# Altium schematic sheet ConnectTech.SchDoc: Sample Sheet Title
size B; Date: MM/DD/YYYY; Author: Sample Author; Organization: ORGANIZATION; Address1: ADDRESS 1; Address2: ADDRESS 2; Address3: ADDRESS 3; Address4: ADDRESS 4; Revision: -; SheetNumber: 1; SheetTotal: 1; ENG_APP_DATE: --/--/--; DSN_APP_DATE: --/--/--; CHK_APP_DATE: --/--/--
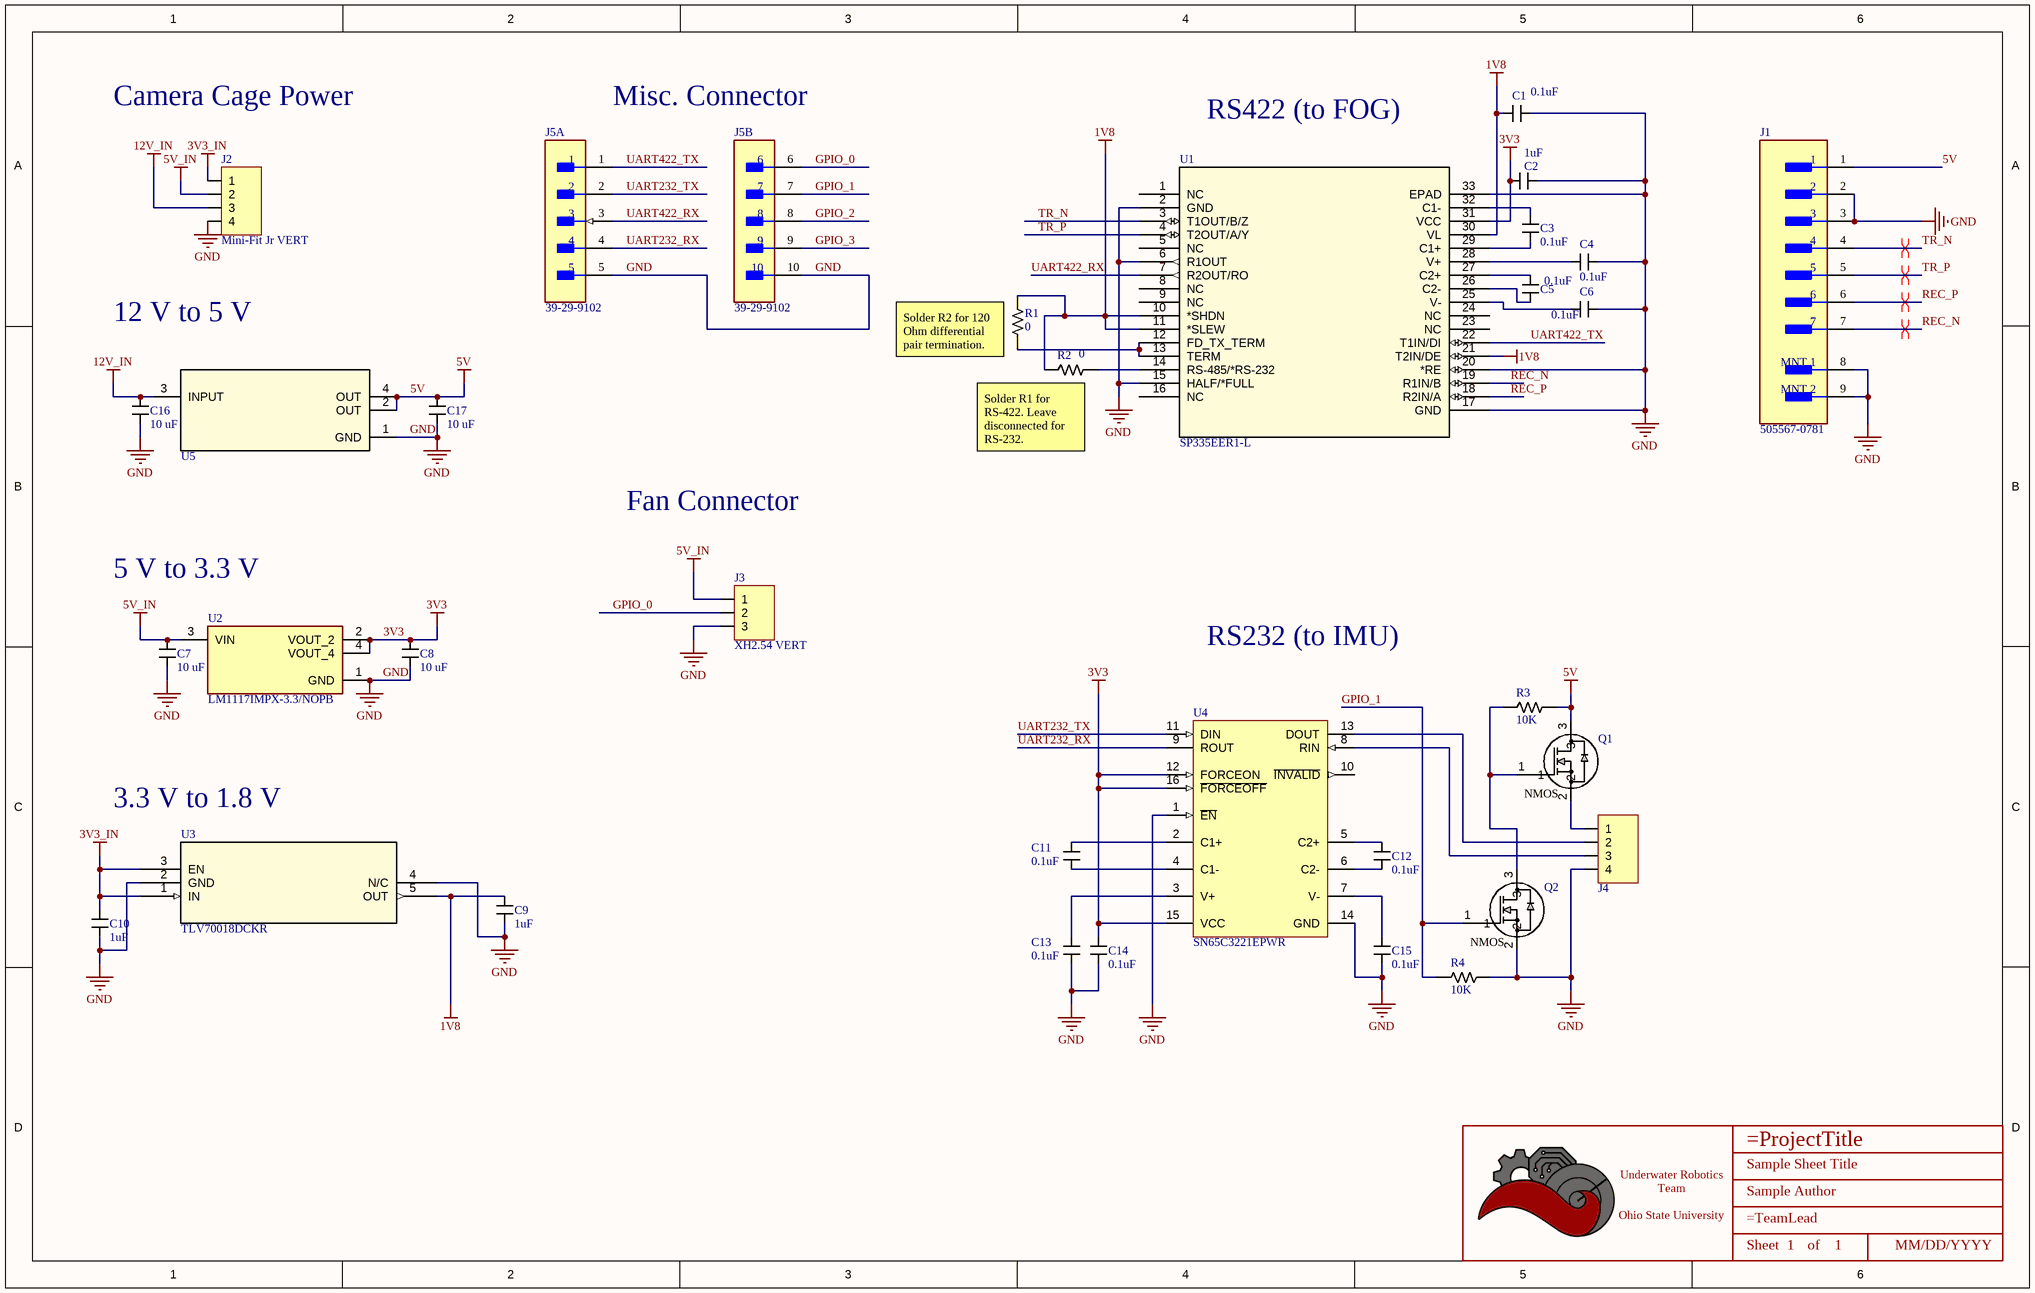
[diagram p0: ConnectTech.SchDoc]

## Parts
*  Title_Block  [LOGO]  (value not drawn)  (graphical)
C1  value 0.1uF  [CAPACITOR_0402]  (hidden comment: 100nF Ceramic 25V)
C2  value 1uF  [CAPACITOR_0402]  (hidden comment: 1uF Ceramic 16V)
C3  value 0.1uF  [CAPACITOR_0402]  (hidden comment: 100nF Ceramic 25V)
C4  value 0.1uF  [CAPACITOR_0402]  (hidden comment: 100nF Ceramic 25V)
C5  value 0.1uF  [CAPACITOR_0402]  (hidden comment: 100nF Ceramic 25V)
C6  value 0.1uF  [CAPACITOR_0402]  (hidden comment: 100nF Ceramic 25V)
C7  Value (uF): 10 uF  [CAPACITOR_0603]  (hidden comment: 10uF Ceramic 6.3V)
C8  Value (uF): 10 uF  [CAPACITOR_0603]  (hidden comment: 10uF Ceramic 6.3V)
C9  value 1uF  [CAPACITOR_0402]  (hidden comment: 1uF Ceramic 16V)
C10  value 1uF  [CAPACITOR_0402]  (hidden comment: 1uF Ceramic 16V)
C11  value 0.1uF  [CAPACITOR_0603]  (hidden comment: 100nF Ceramic 6.3V)
C12  value 0.1uF  [CAPACITOR_0603]  (hidden comment: 100nF Ceramic 6.3V)
C13  value 0.1uF  [CAPACITOR_0603]  (hidden comment: 100nF Ceramic 6.3V)
C14  value 0.1uF  [CAPACITOR_0603]  (hidden comment: 100nF Ceramic 6.3V)
C15  value 0.1uF  [CAPACITOR_0603]  (hidden comment: 100nF Ceramic 6.3V)
C16  Value (uF): 10 uF  [CAPACITOR_0603]  (hidden comment: 10uF Ceramic 6.3V)
C17  Value (uF): 10 uF  [CAPACITOR_0603]  (hidden comment: 10uF Ceramic 6.3V)
J1  505567-0781  [FP-505567-0781-MFG]
J2  Mini-Fit Jr VERT  [CONN_MOLEX_MINIFIT JR_4 POS_VERT]
J3  XH2.54 VERT  [CONN_JST_XH254_3POS_VERT]
J4  XH2.54 VERT  [CONN_JST_XH254_4POS_VERT]  (value not drawn)
J5  39-29-9102  [FP-39-29-9102-MFG]  (parts A,B of 2)
Q1  MOSFET N-CH 30V 5.8A SOT-23-3  [SOT-23-3]  (value not drawn)
Q2  MOSFET N-CH 30V 5.8A SOT-23-3  [SOT-23-3]  (value not drawn)
R1  Value  (Ohms): 0  [RESISTOR_0402]  (hidden comment: 0 Ohm 1% 1/16W)
R2  Value  (Ohms): 0  [RESISTOR_0402]  (hidden comment: 0 Ohm 1% 1/16W)
R3  Value  (Ohms): 10K  [RESISTOR_0603]  (hidden comment: 10k Ohm 5% 1/10W)
R4  Value  (Ohms): 10K  [RESISTOR_0603]  (hidden comment: 10k Ohm 5% 1/10W)
U1  SP335EER1-L  [QFN-32]
U2  LM1117IMPX-3.3/NOPB  [SOT-223-4]
U3  TLV70018DCKR  [SOT-353]
U4  SN65C3221EPWR  [PW0016A_M]
U5  LM1117IMPX-5.0/NOPB  [SOT-223-4]  (value not drawn)

## Nets
1V8: C1.1 C9.1 R1.2 R2.2 U1.10(*SHDN) U1.11(*SLEW) U1.21(T2IN/DE) U1.30(VL) U3.5(OUT)
3V3: C2.1 C8.1 C14.1 U1.31(VCC) U2.2(VOUT_2) U2.4(VOUT_4) U4.12(FORCEON) U4.15(VCC) U4.16(~{FORCEOFF})
3V3_IN: C10.1 J2.1 U3.1(IN) U3.3(EN)
5V: C17.1 J1.1 Q1.3 R3.1 U5.2(OUT) U5.4(OUT)
5V_IN: C7.1 J2.2 J3.1 U2.3(VIN)
12V_IN: C16.1 J2.3 U5.3(INPUT)
GND: C1.2 C2.2 C4.2 C6.2 C7.2 C8.2 C9.2 C10.2 C13.2 C14.2 C15.2 C16.2 C17.2 J1.2 J1.3 J1.8(MNT_1) J1.9(MNT_2) J2.4 J3.3 J4.4 J5.5 J5.10 Q2.2 R4.2 U1.2(GND) U1.6(R1OUT) U1.15(HALF/*FULL) U1.17(GND) U1.20(*RE) U1.33(EPAD) U2.1(GND) U3.2(GND) U3.4(N/C) U4.1(~{EN}) U4.14(GND) U5.1(GND)
GPIO_0: J3.2 J5.6
GPIO_1: J5.7 Q2.1 R4.1
GPIO_2: J5.8
GPIO_3: J5.9
REC_N: J1.7 U1.19(R1IN/B)
REC_P: J1.6 U1.18(R2IN/A)
TR_N: J1.4 U1.3(T1OUT/B/Z)
TR_P: J1.5 U1.4(T2OUT/A/Y)
UART232_RX: J5.4 U4.9(ROUT)
UART232_TX: J5.2 U4.11(DIN)
UART422_RX: J5.3 U1.7(R2OUT/RO)
UART422_TX: J5.1 U1.22(T1IN/DI)
NetC3_1: C3.1 U1.32(C1-)
NetC3_2: C3.2 U1.29(C1+)
NetC4_1: C4.1 U1.28(V+)
NetC5_1: C5.1 U1.27(C2+)
NetC5_2: C5.2 U1.26(C2-)
NetC6_1: C6.1 U1.25(V-)
NetC11_1: C11.1 U4.2(C1+)
NetC11_2: C11.2 U4.4(C1-)
NetC12_1: C12.1 U4.5(C2+)
NetC12_2: C12.2 U4.6(C2-)
NetC13_1: C13.1 U4.3(V+)
NetC15_1: C15.1 U4.7(V-)
NetJ4_1: J4.1 Q1.2
NetJ4_2: J4.2 U4.13(DOUT)
NetJ4_3: J4.3 U4.8(RIN)
NetQ1_1: Q1.1 Q2.3 R3.2
NetR1_1: R1.1 U1.12(FD_TX_TERM) U1.13(TERM)
NetR2_1: R2.1 U1.14(RS-485/*RS-232)

Not connected (* = marked no-connect by the designer): U1 1(NC) 5(NC) 8(NC) 9(NC) 16(NC) 23(NC) 24(NC); U4 10(~{INVALID})

## Layout directives
differential pair: REC_N, REC_P, TR_N, TR_P

## Notes on the sheet
- Camera Cage Power
- Misc. Connector
- RS422 (to FOG)
- 12 V to 5 V
- (near R1) Solder R2 for 120 Ohm differential pair termination.
- (near R2) Solder R1 for RS-422. Leave disconnected for RS-232.
- Fan Connector
- 5 V to 3.3 V
- RS232 (to IMU)
- 3.3 V to 1.8 V
- DWG. NO.
- REV.
- SHT.
- THIS DOCUMENT AND THE DATA DISCLOSED HEREIN OR HEREWITH IS THE PROPERTY OF ALTIUM LIMITED AND MAY BE FREELY DISTRIBUTED IN WHOLE. NO RIGHTS ARE RESERVED OR EXPRESS OR IMPLIED WARANTEE GIVEN.
- REVISION
- DESCRIPTION
- DATE
- APPROVED
- ENG:
- APPROVALS
- PROJECT
- DSN:
- CHK:
- REFERENCE DOCUMENTS
- PROJECT REVISION:
- TITLE
- DOCUMENT REVISION:
- DESIGN ITEM:
- BOM:
- FAB DWG:
- PCB DWG:
- ASSY DWG:
- SCALE:
- SIZE
- B
- CAGE CODE
- FILE NAME
- DWG NO.
- SHEET
- OF
- REV
- (in symbol AO3404A) NMOS
- (in symbol Title_Block) Underwater Robotics Team / Ohio State University; Sheet; of

## Library data of the parts
* = Title_Block: UWRT Schematic Title Block Template / Created June 2021, Dylan Trainor
C1 C3-C6 = CAPACITOR_0.1uF_0402: Cap 100nF 25V +/-10% / Ceramic 0402; Made By: Robert Pafford; Tolerance: +/- 10%; Voltage: 25V; Supplier 1: Digi-Key; Supplier Part Number 1: 478-7868-1-ND
C2 C9 C10 = CAPACITOR_1uF_0402: Cap 1uF 16V +/-10% / Ceramic 0402; Made By: Robert Pafford; Tolerance: +/- 10%; Voltage: 16V; Supplier 1: Digi-Key; Supplier Part Number 1: 478-0402YD105KAT4ADKR-ND
C7 C8 C16 C17 = CAPACITOR_10uF_0603: Cap 10uF 6.3V +/-20% / Ceramic 0603; Made By: Flip B; ComponentLink1Description: Digikey; ComponentLink1URL: https://www.digikey.com/en/products/detail/samsung-electro-mechanics/CL10A106MQ8NNNC/3886777; Supplier 1: Digi-Key; Supplier Part Number 1: 1276-1119-1-ND; Tolerance: +/- 20%; Voltage: 6.3V
C11-C15 = CAPACITOR_0.1uF_0603: Cap 100nF 6.3V +/-10% / Ceramic 0603; Made By: Flip B; ComponentLink1Description: Datsheet; ComponentLink1URL: https://www.mouser.com/datasheet/2/212/KEM_C1002_X7R_SMD-1102033.pdf; Tolerance: +/- 10%; Voltage: 6.3V; Supplier 1: Digi-Key; Supplier Part Number 1: 399-15351-1-ND
J1 = CMP-00257-87166176-1: 505567-0781 Conn Shrouded Header (4 Sides) HDR 7 POS 1.25mm Solder RA Side Entry SMD Micro-Lock PLUS T/R; Manufacturer Lifecycle Status: ACTIVE; Plating: Gold; Number of Circuits: 7; Number of Rows: 1; NexarPartId: 87166176; Contact Plating: Gold; Lifecycle Status: Production; Orientation: Right Angle; Country of Origin: MY; RoHS: Compliant
J2 = CONN_MOLEX_MINIFIT JR_4POS_VERT: Molex Minifit Jr. 5566 / 4 Pos Vertical Natural; Pitch: 4.2mm; Current Per Pin: 13A; Number of Positions: 4; Manufacturer: Molex; Configuration: Vertical; Color: Natural; Created By: Robert P; Series: Minifit Jr 5566; Supplier 1: Digi-Key; Supplier Part Number 1: WM3801-ND
J3 = CONN_JST_XH254_3POS_VERT: JST XH 2.54mm Pitch 3 Pos Vertical; Current Per Pin: 4A; Number of Positions: 3; NOTE: Do not use JST 2.5mm parts with this footprint. JST does not make 2.54mm pitch pins, rather only clones make this connector!; Manufacturer: JST; Pitch: 2.54mm; Configuration: Vertical; Color: White; Created By: Robert P; Series: XH 2.54; ComponentLink1Description: Purchase Link; ComponentLink1URL: https://www.amazon.com/460PCS-XH2-54-Connector-Terminal-Connectors/dp/B09DBGVX5C
J4 = CONN_JST_XH254_4POS_VERT: JST XH 2.54mm Pitch 4 Pos Vertical; Current Per Pin: 4A; Number of Positions: 4; NOTE: Do not use JST 2.5mm parts with this footprint. JST does not make 2.54mm pitch pins, rather only clones make this connector!; Manufacturer: JST; Pitch: 2.54mm; Configuration: Vertical; Color: White; Created By: Robert P; Series: XH 2.54; ComponentLink1Description: Purchase Link; ComponentLink1URL: https://www.amazon.com/460PCS-XH2-54-Connector-Terminal-Connectors/dp/B09DBGVX5C
J5 = CMP-00257-00945216-1: 39-29-9102 Connector Wire to Board Header 10 Position 4.2mm Solder Straight Thru-Hole Tray; NexarPartId: 945216; Manufacturer Lifecycle Status: ACTIVE; Number of Contacts: 10; Voltage Rating (DC): 600V; Plating: Tin; Insulation Resistance: 1GΩ; Max Current Rating: 7A; Gender: Male; Glow Wire Compliant: Non-compliant; Contact Resistance: 10mΩ; Max Voltage Rating (DC): 600.6kV; Height: 13.3mm; Pitch: 4.2mm; Mount: Through Hole; Max Operating Temperature: 105°C; Termination: Solder; Radiation Hardening: No; Flammability Rating: UL94 V-0; Contact Plating: Tin; Number of Rows: 2; Country of Origin: US; Lead Free: Lead Free; Row Spacing: 4.2mm; Color: Natural; Lifecycle Status: Production; Housing Color: Natural; Halogen Free: Low Halogen; Number of Circuits: 10; Min Operating Temperature: -40°C; Schedule B: 8536694040; Voltage Rating: 600V; Contact Gender: Male; Lead Pitch: 4.2mm; Contact Material: Brass; Orientation: Vertical; Housing Material: Nylon; RoHS: Compliant; Current Rating: 7A; Number of Positions: 10
Q1 Q2 = AO3404A: N-Channel 30 V 5.8A (Ta) 1.4W (Ta) Surface Mount SOT-23-3; Vendor: Alpha & Omega Semiconductor Inc.; SourceLibrary: ON_Semiconductor_2020-01-13; Vgs (Max): 3V @ 5.8A, 10V; Vgs (th): 3V @ 250µA; Rds (on): 28mOhm @ 5.8A, 10V; Amp Rating: 5.8 A; FET Type: N-Channel; Package: SOT23-3L; Manufacturer _Part_Number: AO3404A; Vdss: 30V; Power Dissipation: 1.4W (Ta); Supplier 1: Digi-Key; Supplier Part Number 1: 785-1004-1-ND; Created By: Dylan T
R1 R2 = RESISTOR_0_0402: RES 0 OHM 1% 1/16W 0402; Tolerance: +/- 1%; Made By: Robert Pafford; Wattage: 1/16W; Supplier 1: Digikey; Supplier Part Number 1: 13-AC0402FR-070RLCT-ND
R3 R4 = RESISTOR_10K_0603: RES 10k OHM 5% 1/10W 0603; Tolerance: +/- 5%; Wattage: 1/8W; Made By: Robert Pafford; ComponentLink1Description: Datasheet; ComponentLink1URL: https://www.bourns.com/docs/product-datasheets/CRxxxxx.pdf; Supplier: Digikey; Digikey Part Numer: CR0603-JW-104ELFTR-ND; Supplier 1: Digi-Key; Supplier Part Number 1: 2019-RK73B1JTTD103JCT-ND
U1 = SP335EER1-L: 1/1, 2/2 Transceiver Full RS232, RS422, RS485 32-QFN (5x5); Supply Voltage: 3V - 5.5V; Created By: Ethan Rosati; Reviewed By: *; Supplier 1: Digikey; Supplier Part Number 1: 1016-1969-ND
U2 = LM1117IMPX-3.3/NOPB: 800-mA 15-V linear voltage regulator 4-SOT-223 -40 to 125; MF: Texas Instruments; Texas_Instruments-Purchase-URL: https://snapeda.com/shop?store=Texas+Instruments&id=410186; Price: None; Mouser-Purchase-URL: https://snapeda.com/shop?store=Mouser&id=410186; MP: LM1117IMPX-3.3/NOPB; Value: *; Availability: Good; Package: SOT-223-4 Texas Instruments; Arrow_Electronics-Purchase-URL: https://snapeda.com/shop?store=Arrow+Electronics&id=410186; SnapEDA_Link: https://www.snapeda.com/parts/LM1117IMPX-3.3/NOPB/Texas%20Instruments/view-part/410186/?ref=snap; DigiKey-Purchase-URL: https://snapeda.com/shop?store=DigiKey&id=410186
U3 = TLV70018DCKR: Fixed Positive LDO Regulator, 1.8V, PMOS, PDSO5; Made By: Ethan Rosati; Max Voltage: 5.5 V; Min Voltage: 2 V; Output Current: 200 mA; Reviewed By: *; Output Voltage: 1.8 V; Supplier 1: Mouser; Supplier Part Number 1: 595-TLV70018DCKR
U4 = CMP-0299-01595-2: 3-V to 5.5-V Single-Channel RS-232 1-Mbit/s Line Driver / Receiver with ±15-kV IEC ESD Protection, -40 to 85 degC, 16-Pin SSOP (DB), Green (RoHS & no Sb/Br); ICC(Max)(mA): 1; ESD HBM(kV): +/-15; Single Supply: TRUE; Supply Voltage(s)(V): 3.3 or 5.0; PackageVersion: revG, Feb-2011; PackageReference: PW0016A; ComponentLink3Description: Package Specification; Drivers Per Package: 1; ComponentLink3URL: http://www.ti.com/litv/pdf/mpds361; Receivers Per Package: 1; IEC-61000-4-2 SUPPORT: TRUE; SubFamily: RS-232; ComponentLink1Description: Manufacturer URL; DatasheetVersion: SLLS694B; ComponentLink2Description: Datasheet; ComponentLink2URL: http://www.ti.com/general/docs/lit/getliterature.tsp?genericPartNumber=SN65C3221E&fileType=pdf; ComponentLink1URL: www.ti.com; RS-232: TRUE; PackageDescription: 16-Pin Plastic Thin Small Outline Package 5 x 4.4 mm Body ,0.65 mm Pitch
U5 = LM1117IMPX-5.0/NOPB: IC REG LINEAR 5V 800MA SOT223-4; Supplier 1: Mouser; Supplier Part Number 1: 926-LM1117IMPX50NOPB